# EasyEDA schematic CanSat.json
TITLE: CANSAT Sensor Array 1; REV: 1.3; Date: 2019-03-15; Sheet: 1/1; Drawn By: juliofco; Company: CEID
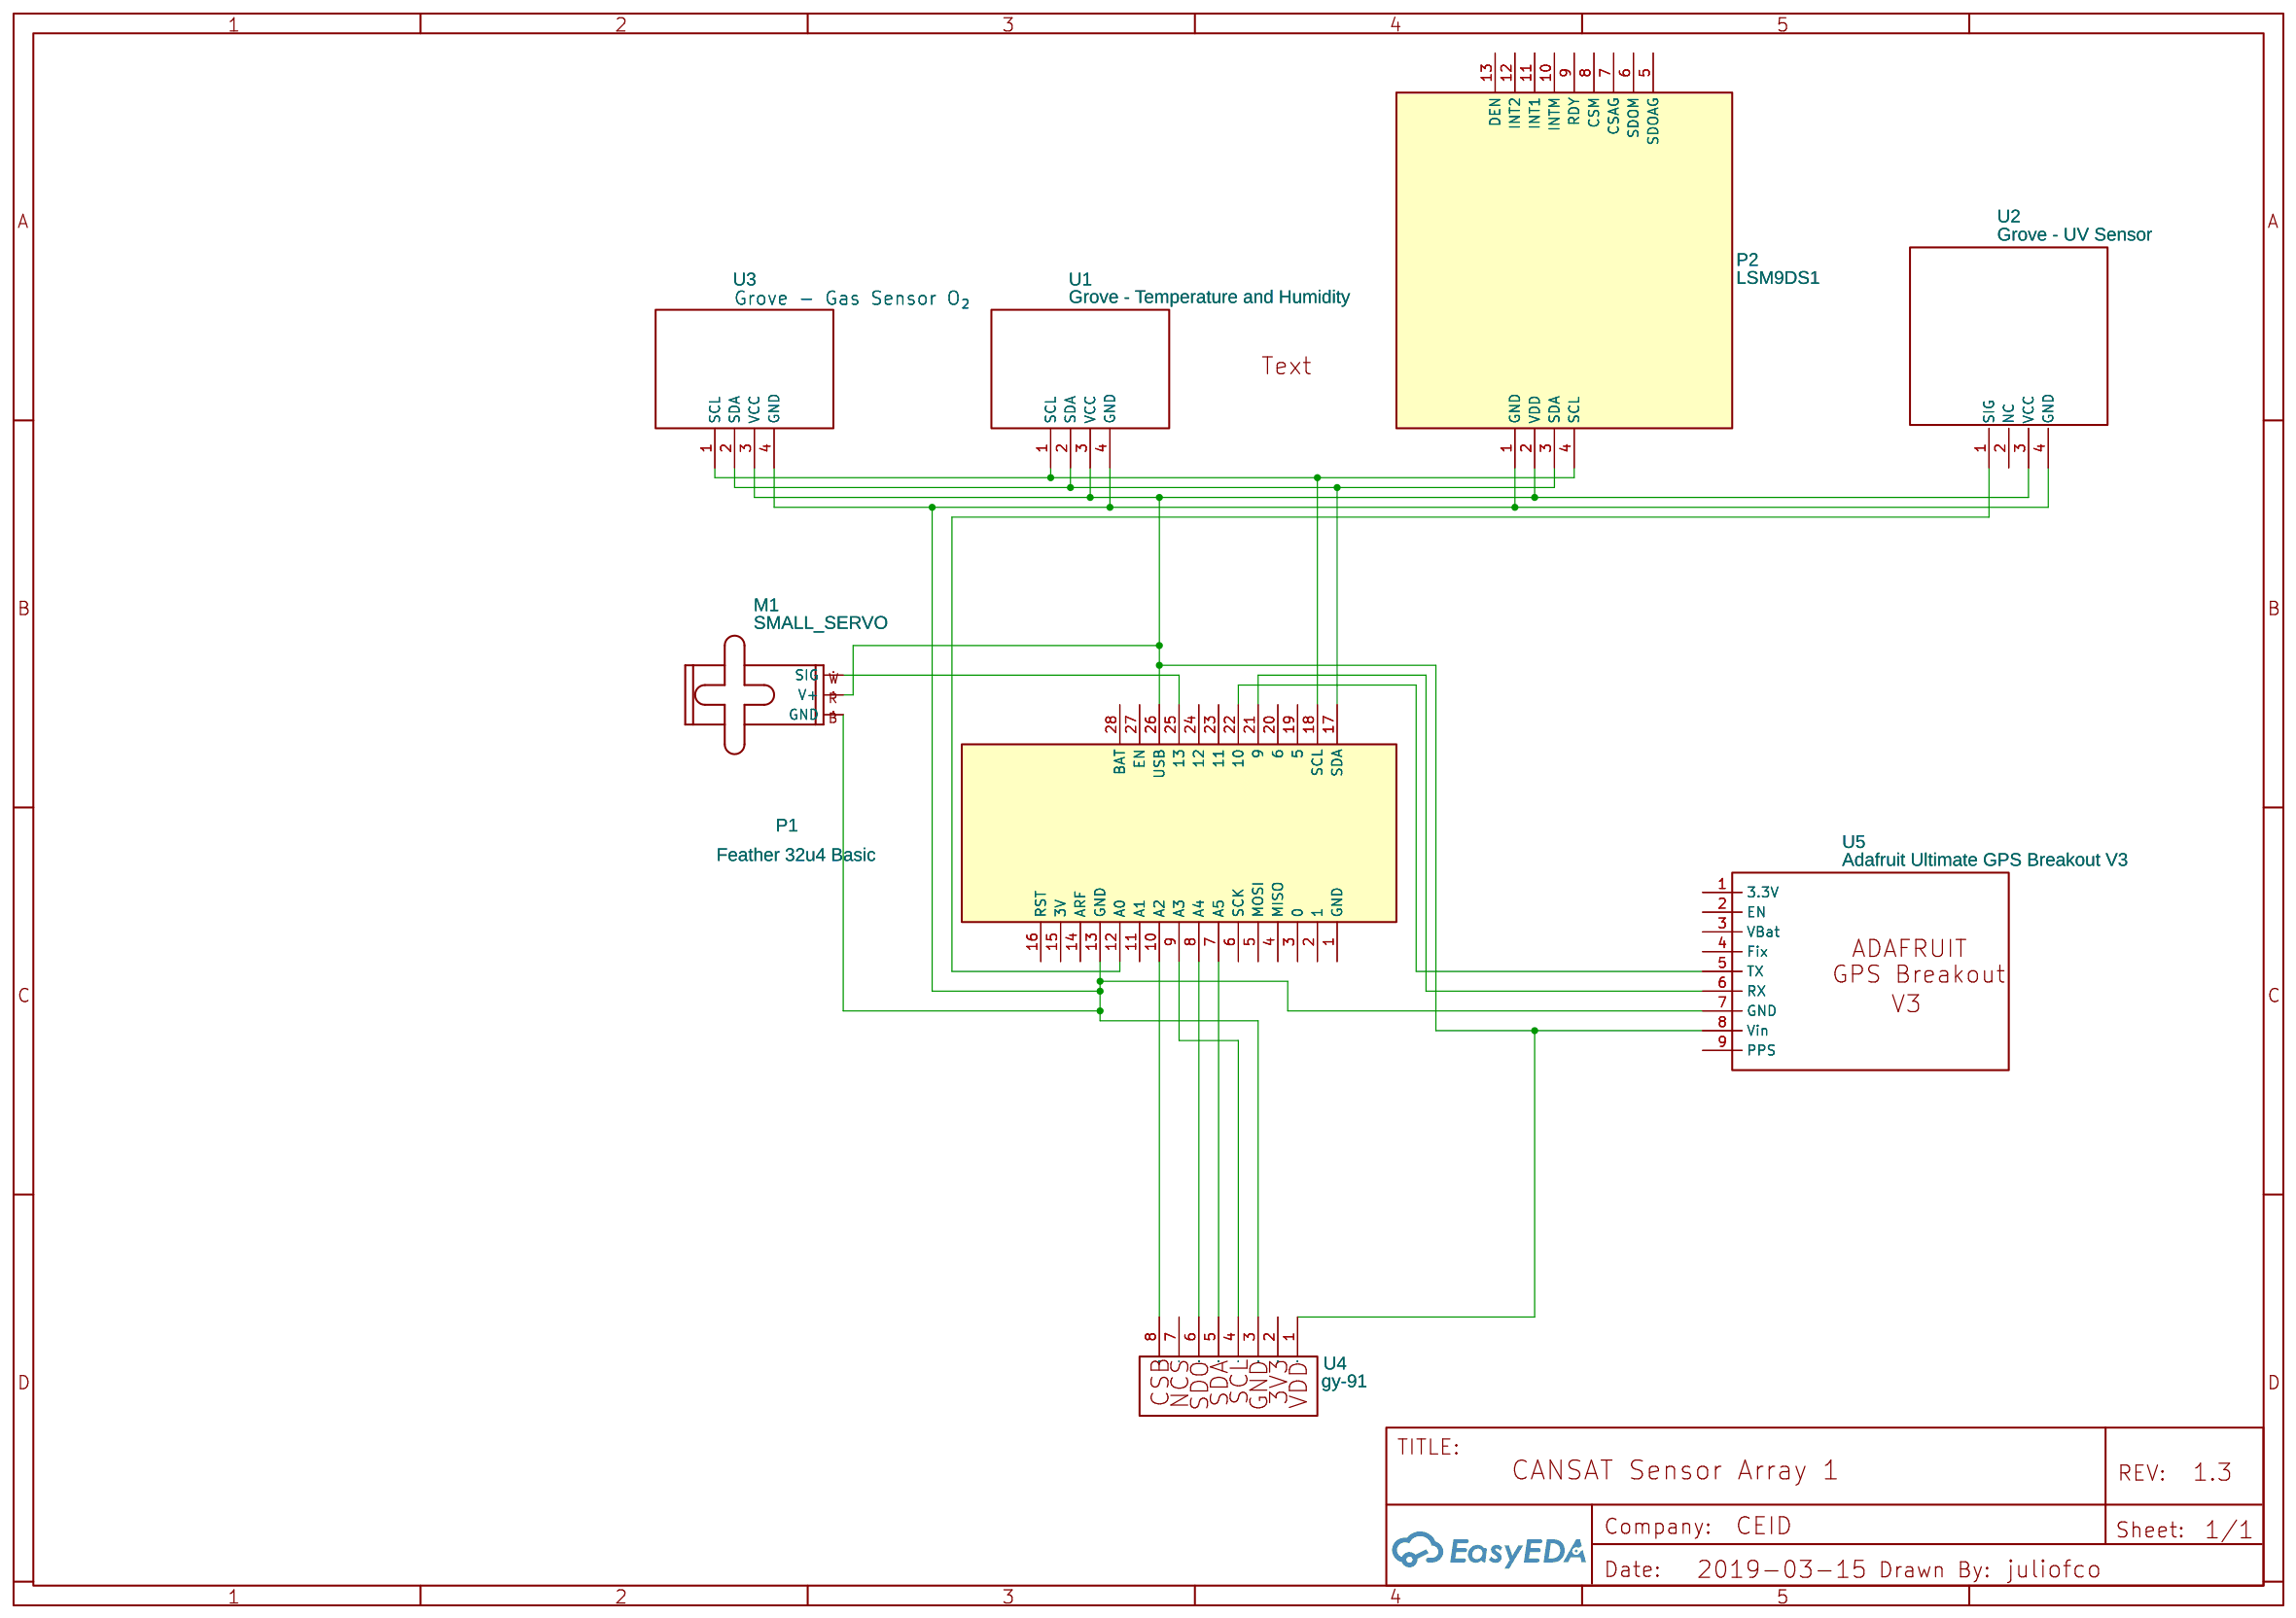
[diagram p0: schematic sheet]

## Parts
M1  SMALL_SERVO  [1X03]
P1  Feather 32u4 Basic  [FEATHER 32U4 BASIC]
P2  LSM9DS1  [LSM9DS1]
U1  Grove - Temperature and Humidity  [GROVE - GAS SENSOR O₂]
U2  Grove - UV Sensor  [GROVE - GAS SENSOR(MQ5)]
U3  Grove - Gas Sensor O₂  [GROVE - GAS SENSOR O₂]
U4  gy-91  [SIP8]
U5  Adafruit Ultimate GPS Breakout V3  [ADAFRUIT GPS BREAKOUT]

## Library data of the parts
M1 = -: Small servo motor; Contributor: SparkFun; Manufacturer Part: ?
P1 P2 = -: sourceId: 1T5FDZYC8; Manufacturer Part: ?
U1 U3 = -: sourceId: gTN5nhzjd; Supplier Part: undefined; Supplier: SeeedStudio; Manufacturer Part: ?
U2 = -: sourceId: yfdbxveAk; Supplier Part: undefined; Supplier: SeeedStudio; Manufacturer Part: ?
U4 = -: Manufacturer Part: sparkfin; Contributor: vasia.platon
U5 = -: Manufacturer Part: New SchematicLib; Contributor: NiklasC; Supplier Part: 746; Supplier: Adafruit; link: https://www.adafruit.com/product/746

## Nets
Net-(M1-1): M1.1(SIG) P1.25(13)
Net-(M1-2): M1.2(V+) P1.26(USB) P2.2(VDD) U1.3(VCC) U2.3(VCC) U3.3(VCC) U4.1 U5.8(Vin)
Net-(M1-3): M1.3(GND) P1.13(GND) P2.1(GND) U1.4(GND) U2.4(GND) U3.4(GND) U4.3 U5.7(GND)
Net-(P1-7): P1.7(A5) U4.5
Net-(P1-8): P1.8(A4) U4.6
Net-(P1-9): P1.9(A3) U4.4
Net-(P1-10): P1.10(A2) U4.8
Net-(P1-12): P1.12(A0) U2.1(SIG)
Net-(P1-17): P1.17(SDA) P2.3(SDA) U1.2(SDA) U3.2(SDA)
Net-(P1-18): P1.18(SCL) P2.4(SCL) U1.1(SCL) U3.1(SCL)
Net-(P1-21): P1.21(9) U5.6(RX)
Net-(P1-22): P1.22(10) U5.5(TX)

Not connected (* = marked no-connect by the designer): P1 1(GND) 2(1) 3(0) 4(MISO) 5(MOSI) 6(SCK) 11(A1) 14(ARF) 15(3V) 16(RST) 19(5) 20(6) 23(11) 24(12) 27(EN) 28(BAT); P2 5(SDOAG) 6(SDOM) 7(CSAG) 8(CSM) 9(RDY) 10(INTM) 11(INT1) 12(INT2) 13(DEN); U2 2(NC); U4 2 7; U5 1(3.3V) 2(EN) 3(VBat) 4(Fix) 9(PPS)
